# Altium schematic sheet Power_Board.SchDoc: MAIN POWER 5V / 3V3 / 1V8
size A4; Date: Not used; ApprovedBy: Not used; CheckedBy: Not used; Author: Not used; CompanyName: STMicroelectronics; DrawnBy: Not used; Engineer: Not used; Organization: Not used; Address1: Not used; Address2: Not used; Address3: Not used; Address4: Not used; DocumentNumber: 9; Revision: Not used; SheetNumber: 8; SheetTotal: 9; CurrentTime: Not used; CurrentDate: Not used; Time: Not used; DocumentFullPathAndName: Not used; DocumentName: Not used; ModifiedDate: Not used; ImagePath: Not used; ProjectName: Not used; Application_BuildNumber: Not used
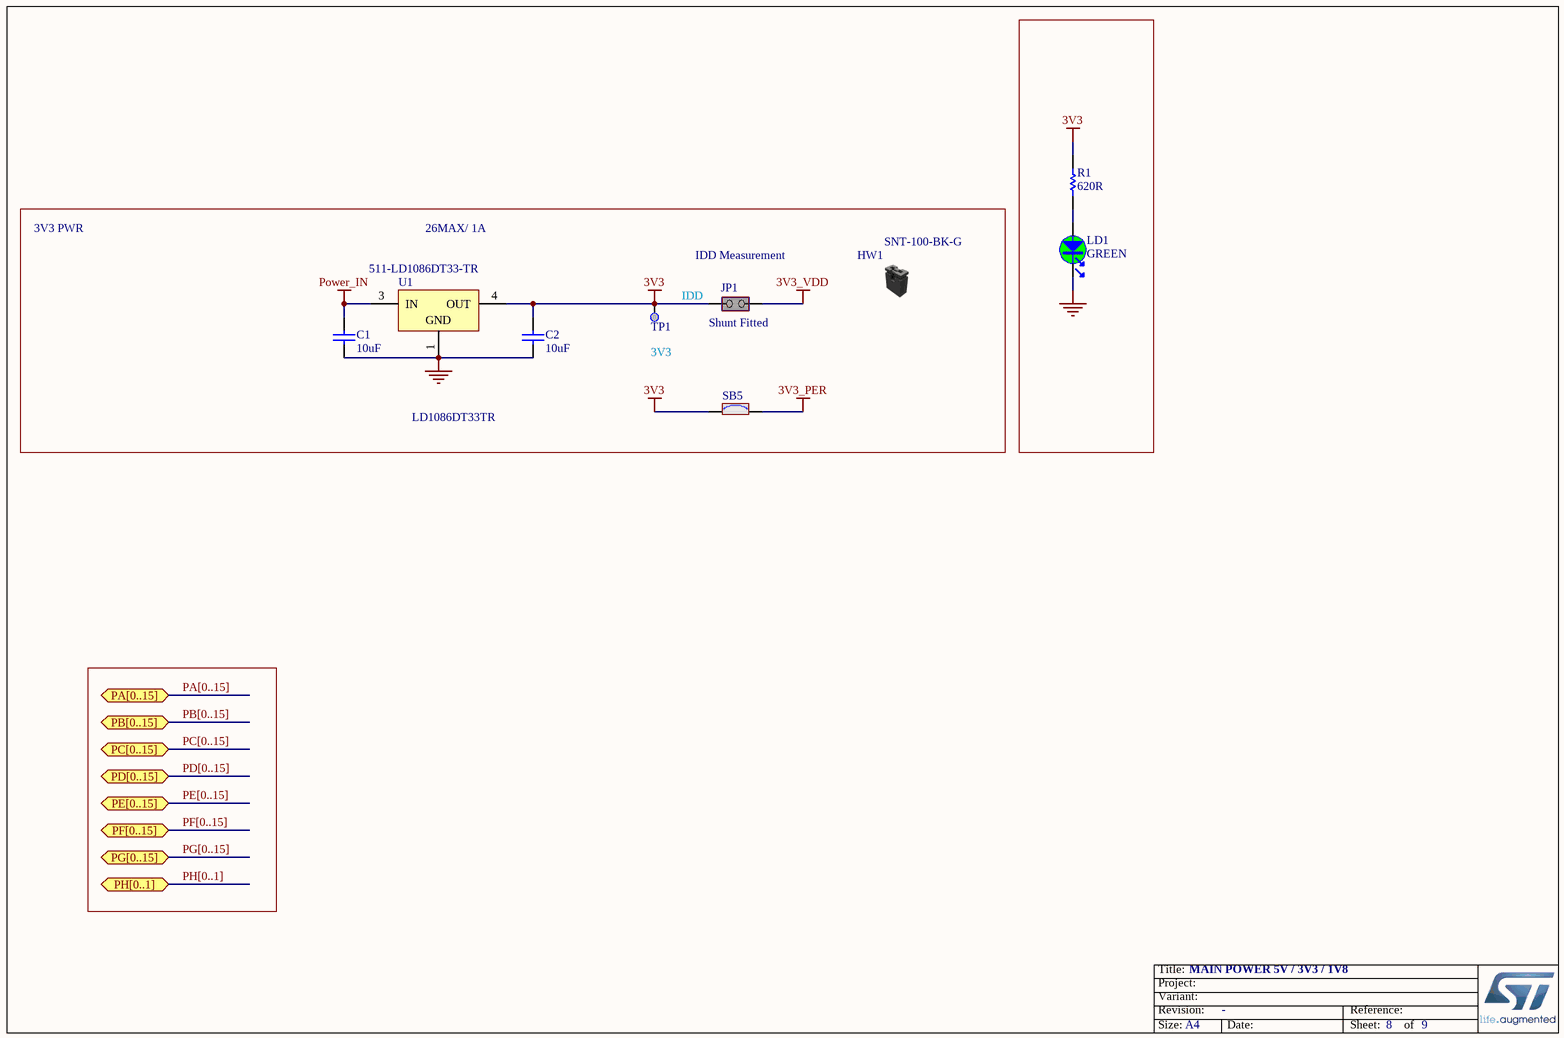
[diagram p0: Power_Board.SchDoc]

## Parts
C1  value 10uF  [C0805]  (hidden comment: Capacitor)
C2  value 10uF  [C0805]  (hidden comment: Capacitor)
HW1  value SNT-100-BK-G  (hidden comment: Shunt Black 2.54mm)  (mechanical)
JP1  value Shunt Fitted  [CON_SAMTEC_TSW-102-07-G-S]  (hidden comment: Jumper_Header 2x1 Fitted)
LD1  value GREEN  [LED_0603_OSRAM_LG-Q396-PS-35_GREEN_1A2K_H0P4]  (hidden comment: LED_green)
R1  value 620R  [R0603]  (hidden comment: Resistor)
SB5  SB_ON  [SOLDER-BRIDGE_R0603-0R]  (value not drawn)
TP1  Test Point  [TP_SMD_1MM]  (value not drawn)  (no BOM)
U1  LD1086DT33TR  Supplier Part Number 1: 511-LD1086DT33-TR  [TO-252_L]

## Ports
PA[0..15] (bidir), PB[0..15] (bidir), PC[0..15] (bidir), PD[0..15] (bidir), PE[0..15] (bidir), PF[0..15] (bidir), PG[0..15] (bidir), PH[0..1] (bidir)

## Nets
3V3: C2.2 JP1.1(COMMON) R1.2 SB5.1 TP1.1 U1.4(OUT)
3V3_PER: SB5.2
3V3_VDD: JP1.2(NO)
GND: C1.1 C2.1 LD1.2 U1.1(GND)
Power_IN: C1.2 U1.3(IN)
NetLD1_1: LD1.1 R1.1

## Buses and harness runs
bus PA[0..15] = port PA[0..15]
bus PB[0..15] = port PB[0..15]
bus PC[0..15] = port PC[0..15]
bus PD[0..15] = port PD[0..15]
bus PE[0..15] = port PE[0..15]
bus PF[0..15] = port PF[0..15]
bus PG[0..15] = port PG[0..15]
bus PH[0..1] = port PH[0..1]

## Notes on the sheet
- 3V3 PWR
- 26MAX/ 1A
- IDD
- (near JP1) IDD Measurement
- (near TP1) 3V3
- Title:
- Project:
- Size:
- Revision:
- Variant:
- A4
- -
- Date:
- Reference:
- Sheet:
- of

## Library data of the parts
C1 C2 = MCD-00014: Capacitor, MLCC, 10uF, 25V, X5R, 10%, 0805, T=0,85mm; Manufacturer_Part_Number: CC0805KRX5R8BB106; Manufacturer: YAGEO; Provided_By: SUBCO; ECCN_US: EAR99; ECCN_EU: NEC; Internal_Part_Number: MCD-00014; ComponentLink1Description: Datasheet; Status: Released; Part_Type: Capacitor; Package: C0805; ComponentLink1URL: http://tunmcdsvn.tun.st.com/Component_Datasheet_Library/Trunk/Capacitors/Yageo_Multilayer_capacitor_X5R_series_100pF_to_100uF
HW1 = MCD-00043: SHUNT 2.54mm BLACK; Manufacturer: SAMTEC; Part_Type: Mechanical; Alternate_Manufacturer_Part_Number: 316102S111A; Alternate_Manufacturer: JIUBABA; Provided_By: SUBCO; Internal_Part_Number: MCD-00043; Manufacturer_Part_Number: SNT-100-BK-G; ComponentLink1Description: Datasheet; Status: Released; ComponentLink1URL: http://tunmcdsvn.tun.st.com/Component_Datasheet_Library/Trunk/Connectors/Samtec_Shunt_Jumper_SNT100; ECCN_US: n/a; ECCN_EU: n/a
JP1 = MCD-00683: Header, 2x1, 2,54mm, VR, TH, Height 5.84mm/2.54mm - Shunt Fitted by default; Part_Type: Connector; Manufacturer_Part_Number: TSW-102-07-x-S; Manufacturer: SAMTEC; Alternate_Manufacturer_Part_Number: 313102S111116; Alternate_Manufacturer: LIANYI; Provided_By: SUBCO; Internal_Part_Number: MCD-00683; Status: Released; ComponentLink1Description: Datasheet; ComponentLink1URL: http://tunmcdsvn.tun.st.com/Component_Datasheet_Library/Trunk/Connectors/Samtec_TSW-HTSW-series; ECCN_US: n/a; ECCN_EU: n/a
LD1 = MCD-00588: LED Green, 0603 SMD, Forward Voltage Typ=2V, Max=2.5V; Part_Type: Display; Manufacturer_Part_Number: LG Q396-PS-35; Manufacturer: OSRAM OPTO SEMICONDUCTORS; Alternate_Manufacturer_Part_Number: VLMTG1300-GS08; Alternate_Manufacturer: VISHAY SEMICONDUCTOR OPTO DIVISION; Provided_By: SUBCO; Internal_Part_Number: MCD-00588; Status: Released; Package: LED 0603; ComponentLink1Description: Datasheet; ComponentLink1URL: http://tunmcdsvn.tun.st.com/Component_Datasheet_Library/Trunk/Display/OSRAM_LED_GREEN_LG Q396-PS-35; Order_Code_Digikey: LG Q396-PS-35-ND; ECCN_US: n/a; ECCN_EU: n/a
R1 = MCD-00500: Resistor,620R,0603,1%,1/10W; Manufacturer_Part_Number: RC0603FR-07620RL; Manufacturer: YAGEO; Provided_By: SUBCO; ECCN_US: EAR99; ECCN_EU: NEC; Internal_Part_Number: MCD-00500; Status: Released; Part_Type: Resistor; Package: R0603; ComponentLink1Description: Datasheet; ComponentLink1URL: http://tunmcdsvn.tun.st.com/Component_Datasheet_Library/Trunk/Resistors/Yageo_Resistor_RC0603-series
SB5 = MCD-00071: Solder Bridge ON; Part_Type: Mechanical; Manufacturer_Part_Number: RC0603JR-070RL; Manufacturer: YAGEO; Provided_By: SUBCO; Internal_Part_Number: MCD-00071; Status: Released; ComponentLink1Description: Datasheet; Package: SB0603; ComponentLink1URL: http://tunmcdsvn.tun.st.com/Component_Datasheet_Library/Trunk/Resistors/Yageo_Resistor_RC0603-series; ECCN_US: n/a; ECCN_EU: n/a
TP1 = MCD-00074: Test Point 1mm; Part_Type: Mechanical; Internal_Part_Number: MCD-00074; Provided_By: n/a; Status: Released; ComponentLink1Description: Datasheet; ComponentLink1URL: http://na; Manufacturer: n/a; Manufacturer_Part_Number: n/a; ECCN_US: n/a; ECCN_EU: n/a
U1 = CMP-0244-00125-1: 1.5A, Low Drop Positive Voltage Regulator, 3.3V, 3-Pin DPAK, Tape and Reel; Manufacturer: STMicroelectronics; Description: STMICROELECTRONICS         LD1086DT33TR            Fixed LDO Voltage Regulator, 6.3V to 30V, 1.3V Dropout, 3.3Vout, 1.5Aout, TO-252-3; Number of Outputs: 1; Max Input Voltage: 30V; Dropout Voltage: 1.3V; Quiescent Current: 10mA; Accuracy: 1%; Output Type: Fixed; Min Input Voltage: 6.3V; Input Bias Current: 5mA; ComponentLink2URL: http://www.st.com/internet/com/TECHNICAL_RESOURCES/TECHNICAL_LITERATURE/DATASHEET/CD00001884.pdf; ComponentLink1URL: http://www.st.com; PackageReference: TO-252; ComponentLink1Description: Manufacturer URL; ComponentLink2Description: Datasheet; PackageVersion: 2011; PackageDescription: 3-Pin Transistor Outline Package 2.28 mm Pitch, 9.7 mm Lead Span (DPAK); DatasheetVersion: 11/07/2011; Supplier 1: Mouser; Manufacturer Part Number: LD1086DT33TR; Stock 1: 11431; Pricing 1: 1=0.97000, 10=0.83500, 50=0.83500, 100=0.64100, 1000=0.44700, 10000=0.38200 (USD); RoHS: Yes; Mount: Surface Mount; Case/Package: DPAK; Number of Pins: 3; Weight: 0.01lb; Min Operating Temperature: -40°C; Max Operating Temperature: 125°C; Output Voltage: 3.3V; Packaging: Tape and Reel; Max Output Current: 1.5A; Output Current: 1.5A; Package Quantity: 1; Polarity: Positive; Nominal Output Voltage: 3.3V; Number of Regulators: 1; Min Output Voltage: 3.3V; Output Voltage Accuracy: 1%; Length: 6.6mm; Height: 2.4mm; Width: 6.2mm; Radiation Hardening: No; REACH SVHC: No SVHC; Lead Free: Lead Free; ComponentLink3URL: https://datasheet.ciiva.com/16593/cd00001884-16593328.pdf?src-supplier=Avnet+Europe; ComponentLink3Description: https://datasheet.ciiva.com/16593/cd00001884-16593328.pdf?src-supplier=Avnet+Europe; ComponentLink4URL: https://datasheet.ciiva.com/2043/cd00001884-2043961.pdf?src-supplier=Digi-Key; ComponentLink4Description: https://datasheet.ciiva.com/2043/cd00001884-2043961.pdf?src-supplier=Digi-Key; ComponentLink5URL: https://datasheet.ciiva.com/3225/cd00001884-3225081.pdf?src-supplier=Avnet; ComponentLink5Description: https://datasheet.ciiva.com/3225/cd00001884-3225081.pdf?src-supplier=Avnet; ComponentLink6URL: https://datasheet.ciiva.com/1511/1880971-1511549.pdf?src-supplier=Element14; ComponentLink6Description: https://datasheet.ciiva.com/1511/1880971-1511549.pdf?src-supplier=Element14; ComponentLink7URL: https://datasheet.ciiva.com/1511/1880971-1511550.pdf?src-supplier=Element14; ComponentLink7Description: https://datasheet.ciiva.com/1511/1880971-1511550.pdf?src-supplier=Element14; ComponentLink8URL: https://datasheet.ciiva.com/2043/cd00001884-2043960.pdf?src-supplier=Digi-Key; ComponentLink8Description: https://datasheet.ciiva.com/2043/cd00001884-2043960.pdf?src-supplier=Digi-Key; ComponentLink9URL: https://datasheet.ciiva.com/2043/cd00001884-2043962.pdf?src-supplier=Digi-Key; ComponentLink9Description: https://datasheet.ciiva.com/2043/cd00001884-2043962.pdf?src-supplier=Digi-Key; ComponentLink10URL: https://datasheet.ciiva.com/16496/cd00001884-16496030.pdf?src-supplier=Future+Electronics; ComponentLink10Description: https://datasheet.ciiva.com/16496/cd00001884-16496030.pdf?src-supplier=Future+Electronics